# Altium project STM32_Phone.PrjPcb
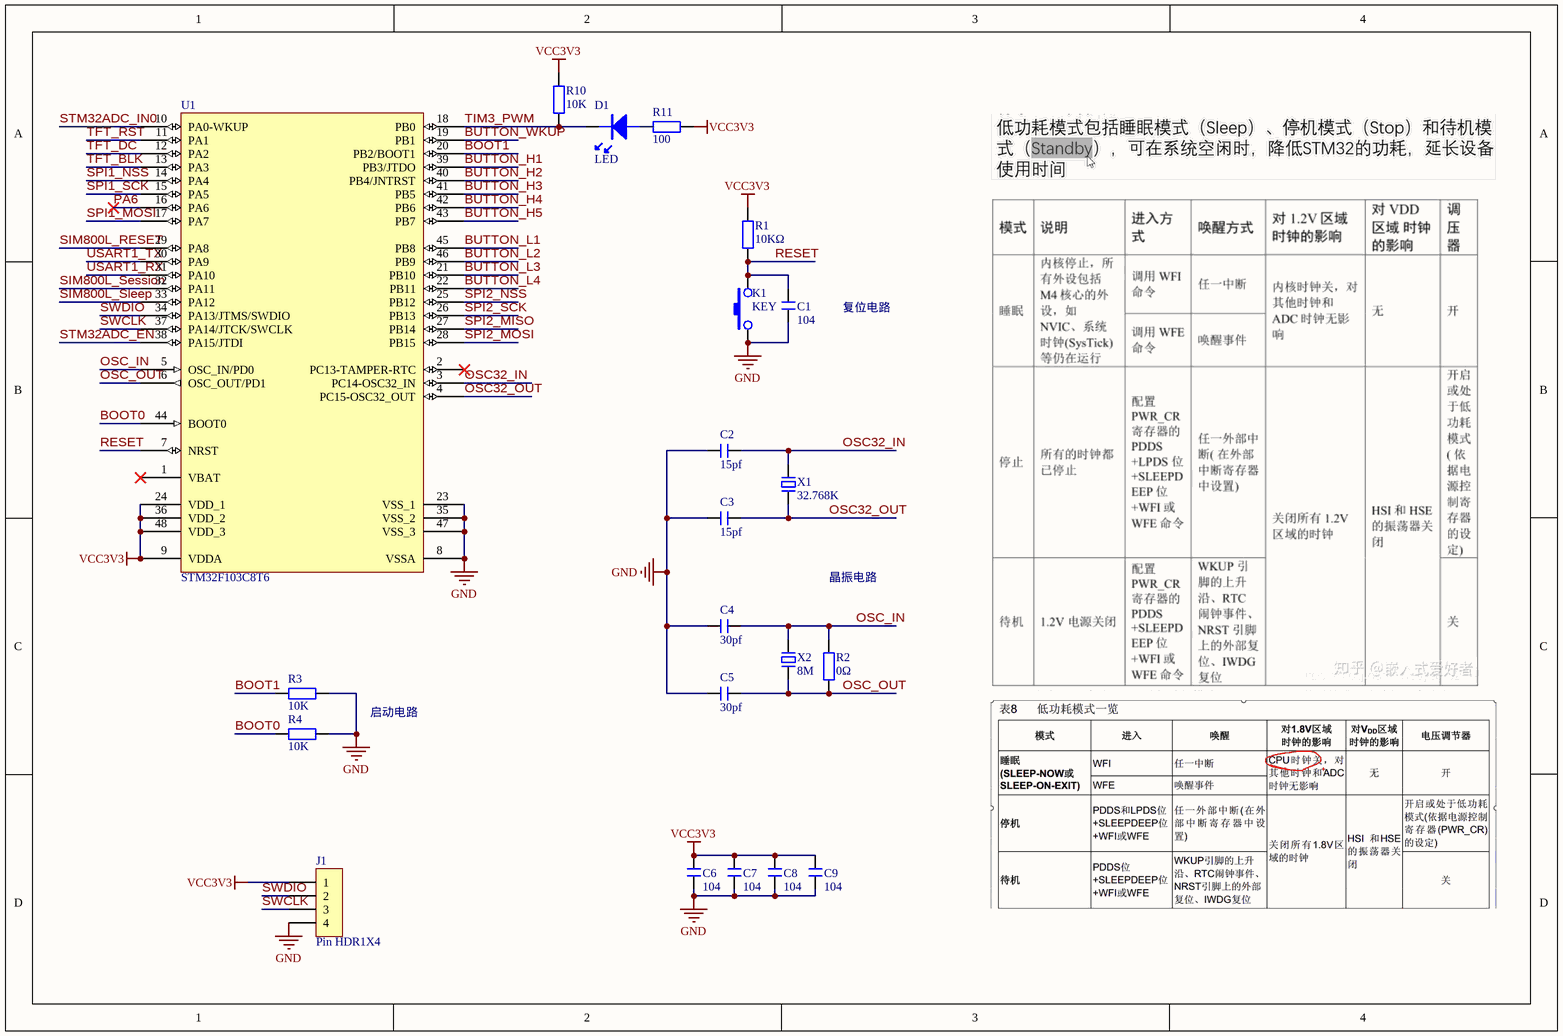
[diagram p0: STM32_miniSystem.SchDoc]
7 sheets, 80 parts. Net scope: global (net labels, ports and power ports of the same name join across sheets).
Board file: Phone.PcbDoc
Sheets:
  STM32_miniSystem.SchDoc
  SIM800L.SchDoc
  DC_DC.SchDoc
  BUTTON.SchDoc
  flash.SchDoc
  DISPLAY.SchDoc
  ACDC.SchDoc

## Sheet STM32_miniSystem.SchDoc
size A4; SheetNumber: 1; SheetTotal: 7

### Parts
C1  104  [C 0805_L]
C2  15pf  [CC 1.8*3.6]
C3  15pf  [CC 1.8*3.6]
C4  30pf  [CC 1.8*3.6]
C5  30pf  [CC 1.8*3.6]
C6  104  [C 0805_L]
C7  104  [C 0805_L]
C8  104  [C 0805_L]
C9  104  [C 0805_L]
D1  LED  [LED-0603G]
J1  Pin HDR1X4  [Pin HDR1X4/2.54mm-W]
K1  KEY  [DIP-12X12X6]
R1  10KΩ  [R 0805_L]
R2  0Ω  [R 0805_L]
R3  10K  [R 0805_L]
R4  10K  [R 0805_L]
R10  10K  [R 0805_L]
R11  100  [R 0805_L]
U1  STM32F103C8T6  [LQFP48 7X7]
X1  32.768K  [OSC-3x10-WI-B]
X2  8M  [OSC HC-49S]

### Nets
GND: C1.1 C2.1 C3.1 C4.1 C5.1 C6.1 C7.1 C8.1 C9.1 J1.4 K1.1 R3.2 R4.1 U1.8(VSSA) U1.23(VSS_1) U1.35(VSS_2) U1.47(VSS_3)
VCC3V3: C6.2 C7.2 C8.2 C9.2 J1.1 R1.2 R10.2 R11.2 U1.9(VDDA) U1.24(VDD_1) U1.36(VDD_2) U1.48(VDD_3)
BOOT0: R4.2 U1.44(BOOT0)
BOOT1: R3.1 U1.20(PB2/BOOT1)
BUTTON_H1: U1.39(PB3/JTDO)
BUTTON_H2: U1.40(PB4/JNTRST)
BUTTON_H3: U1.41(PB5)
BUTTON_H4: U1.42(PB6)
BUTTON_H5: U1.43(PB7)
BUTTON_L1: U1.45(PB8)
BUTTON_L2: U1.46(PB9)
BUTTON_L3: U1.21(PB10)
BUTTON_L4: U1.22(PB11)
BUTTON_WKUP: U1.19(PB1)
OSC32_IN: C2.2 U1.3(PC14-OSC32_IN) X1.2
OSC32_OUT: C3.2 U1.4(PC15-OSC32_OUT) X1.1
OSC_IN: C4.2 R2.2 U1.5(OSC_IN/PD0) X2.2
OSC_OUT: C5.2 R2.1 U1.6(OSC_OUT/PD1) X2.1
PA6: U1.16(PA6)
RESET: C1.2 K1.3 R1.1 U1.7(NRST)
SIM800L_RESET: U1.29(PA8)
SIM800L_Session: U1.32(PA11)
SIM800L_Sleep: U1.33(PA12)
SPI1_MOSI: U1.17(PA7)
SPI1_NSS: U1.14(PA4)
SPI1_SCK: U1.15(PA5)
SPI2_MISO: U1.27(PB14)
SPI2_MOSI: U1.28(PB15)
SPI2_NSS: U1.25(PB12)
SPI2_SCK: U1.26(PB13)
STM32ADC_EN: U1.38(PA15/JTDI)
STM32ADC_IN0: U1.10(PA0-WKUP)
SWCLK: J1.3 U1.37(PA14/JTCK/SWCLK)
SWDIO: J1.2 U1.34(PA13/JTMS/SWDIO)
TFT_BLK: U1.13(PA3)
TFT_DC: U1.12(PA2)
TFT_RST: U1.11(PA1)
TIM3_PWM: D1.K R10.1 U1.18(PB0)
USART1_RX: U1.31(PA10)
USART1_TX: U1.30(PA9)
NetD1_A: D1.A R11.1

Not connected (* = marked no-connect by the designer): U1 1(VBAT)* 2(PC13-TAMPER-RTC)*

### Notes on the sheet
- 复位电路
- 晶振电路
- 启动电路

### Library data of the parts
C1 C6-C9 = C: 无极性贴片电容; 版权归属: 源创客; 材质: X7R; BOM名称: 无极性贴片电容; 学习资源: www.ooocke.com
C2 C3 = C-CC_1: 直插瓷片电容; 版权归属: 源创客; BOM名称: 直插瓷片电容; 学习资源: www.ooocke.com
C4 C5 = C-CC_2: 直插瓷片电容; 版权归属: 源创客; BOM名称: 直插瓷片电容; 学习资源: www.ooocke.com
R1 R2 = R: 贴片电阻; 版权归属: 源创客; BOM名称: 贴片电阻; 学习资源: www.ooocke.com
R3 R4 R10 = R_3: 贴片电阻; 版权归属: 源创客; BOM名称: 贴片电阻; 学习资源: www.ooocke.com
R11 = R_2: 贴片电阻; 版权归属: 源创客; BOM名称: 贴片电阻; 学习资源: www.ooocke.com
X1 = XTAL-2P: 32.768K_2脚无源脚晶振
X2 = XTAL-2P_1: 8M_2脚无源脚晶振

## Sheet SIM800L.SchDoc
size A4; SheetNumber: 2; SheetTotal: 7
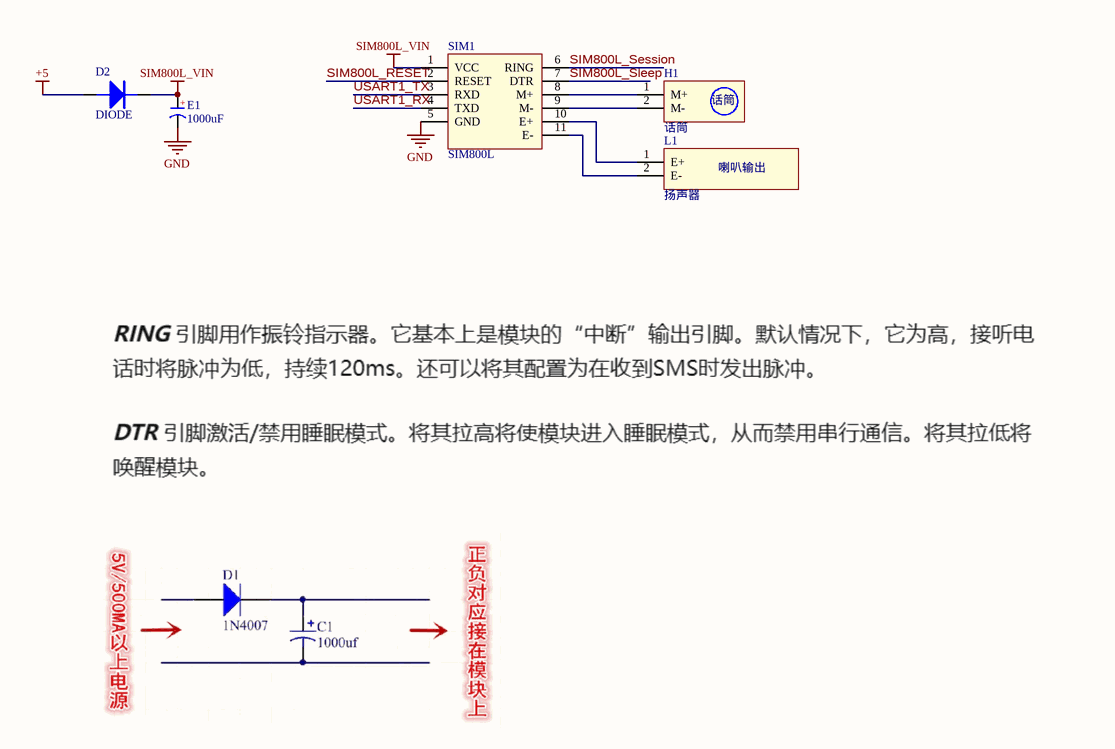
[diagram p1: SIM800L.SchDoc]

### Parts
D2  DIODE  [DO-15]
E1  1000uF  [CAP 1.5*4*8]
H1  话筒  [话筒]
L1  扬声器  [扬声器]
SIM1  SIM800L  [SIM800L]

### Nets
+5: D2.A
GND: E1.2(K) SIM1.5(GND)
SIM800L_VIN: D2.K E1.1(A) SIM1.1(VCC)
SIM800L_RESET: SIM1.2(RESET)
SIM800L_Session: SIM1.6(RING)
SIM800L_Sleep: SIM1.7(DTR)
USART1_RX: SIM1.4(TXD)
USART1_TX: SIM1.3(RXD)
NetH1_1: H1.1(M+) SIM1.8(M+)
NetH1_2: H1.2(M-) SIM1.9(M-)
NetL1_1: L1.1(E+) SIM1.10(E+)
NetL1_2: L1.2(E-) SIM1.11(E-)

### Notes on the sheet
- (in symbol C-CAP) +
- (in symbol 扬声器) 喇叭输出

### Library data of the parts
D2 = DIODE: 普通二极管
E1 = C-CAP: 直插电解电容; 版权归属: 源创客; BOM名称: 直插电解电容; 学习资源: www.ooocke.com

## Sheet DC_DC.SchDoc
size A4; SheetNumber: 3; SheetTotal: 7
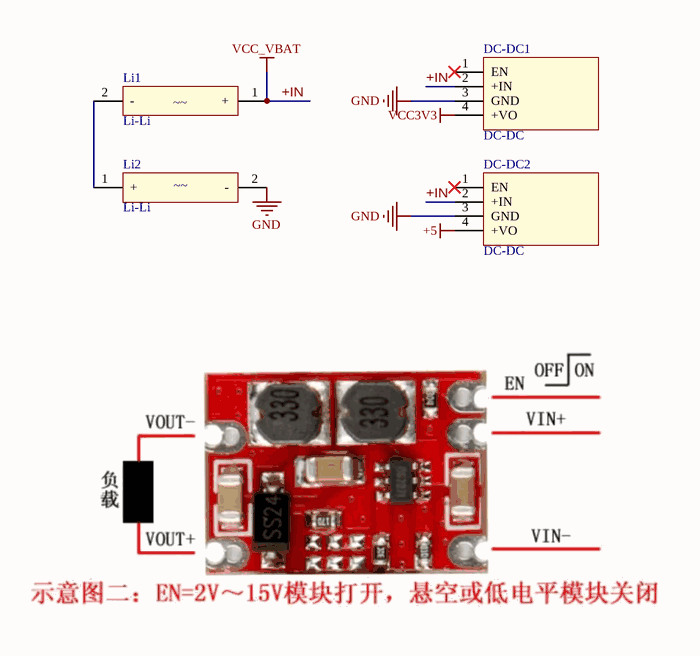
[diagram p2: DC_DC.SchDoc]

### Parts
DC-DC1  DC-DC  [DC-DC]
DC-DC2  DC-DC  [DC-DC]
Li1  Li-Li  [单个5号电池盒]
Li2  Li-Li  [单个5号电池盒]

### Nets
+5: DC-DC2.4(+VO)
+IN: DC-DC1.2(+IN) DC-DC2.2(+IN) Li1.1(+)  [also labelled VCC_VBAT]
GND: DC-DC1.3(GND) DC-DC2.3(GND) Li2.2(-)
VCC3V3: DC-DC1.4(+VO)
NetLi1_2: Li1.2(-) Li2.1(+)

Not connected (* = marked no-connect by the designer): DC-DC1 1(EN)*; DC-DC2 1(EN)*

### Notes on the sheet
- (in symbol Li-Li) ~~

## Sheet BUTTON.SchDoc
size A3; SheetNumber: 4; SheetTotal: 7
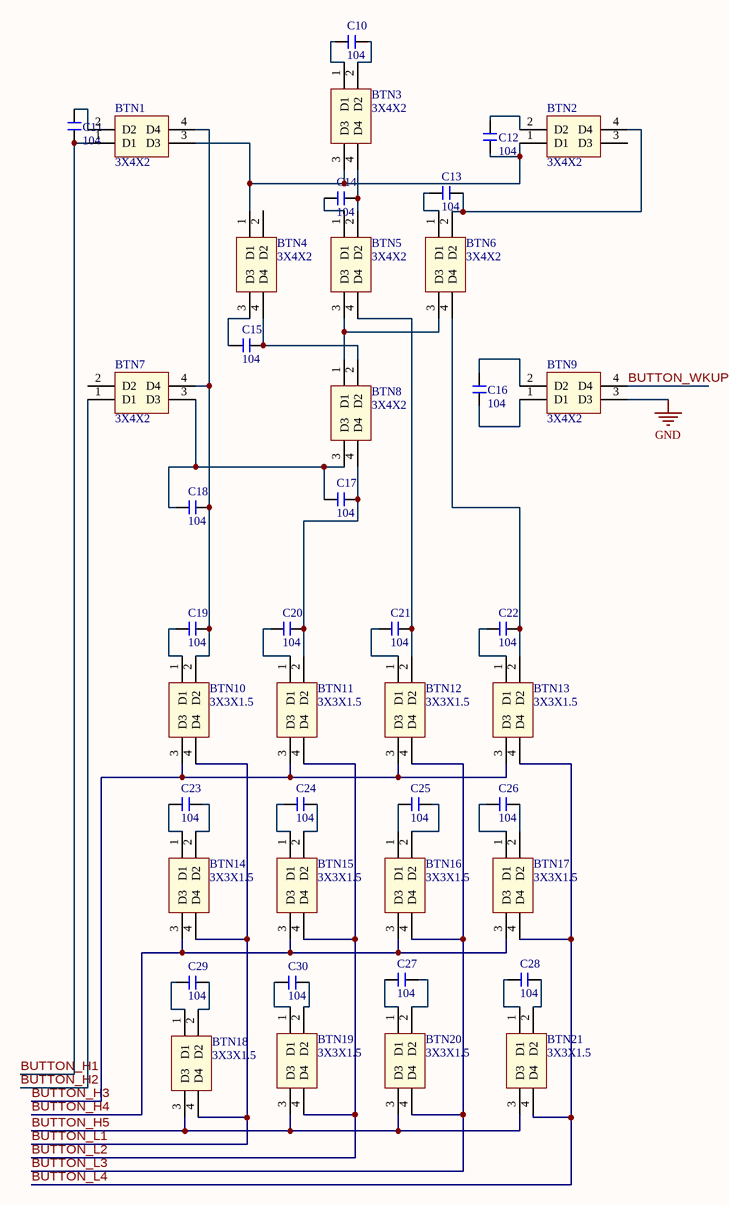
[diagram p3: BUTTON.SchDoc]

### Parts
BTN1  3X4X2  [3X4X2按钮]
BTN2  3X4X2  [3X4X2按钮]
BTN3  3X4X2  [3X4X2按钮]
BTN4  3X4X2  [3X4X2按钮]
BTN5  3X4X2  [3X4X2按钮]
BTN6  3X4X2  [3X4X2按钮]
BTN7  3X4X2  [3X4X2按钮]
BTN8  3X4X2  [3X4X2按钮]
BTN9  3X4X2  [3X4X2按钮]
BTN10  3X3X1.5  [3X3X1.5]
BTN11  3X3X1.5  [3X3X1.5]
BTN12  3X3X1.5  [3X3X1.5]
BTN13  3X3X1.5  [3X3X1.5]
BTN14  3X3X1.5  [3X3X1.5]
BTN15  3X3X1.5  [3X3X1.5]
BTN16  3X3X1.5  [3X3X1.5]
BTN17  3X3X1.5  [3X3X1.5]
BTN18  3X3X1.5  [3X3X1.5]
BTN19  3X3X1.5  [3X3X1.5]
BTN20  3X3X1.5  [3X3X1.5]
BTN21  3X3X1.5  [3X3X1.5]
C10  104  [C 0805_L]
C11  104  [C 0805_L]
C12  104  [C 0805_L]
C13  104  [C 0805_L]
C14  104  [C 0805_L]
C15  104  [C 0805_L]
C16  104  [C 0805_L]
C17  104  [C 0805_L]
C18  104  [C 0805_L]
C19  104  [C 0805_L]
C20  104  [C 0805_L]
C21  104  [C 0805_L]
C22  104  [C 0805_L]
C23  104  [C 0805_L]
C24  104  [C 0805_L]
C25  104  [C 0805_L]
C26  104  [C 0805_L]
C27  104  [C 0805_L]
C28  104  [C 0805_L]
C29  104  [C 0805_L]
C30  104  [C 0805_L]

### Nets
GND: BTN9.3(D3)
BUTTON_H1: BTN1.1(D1) C11.1
BUTTON_H2: BTN7.1(D1)
BUTTON_H3: BTN10.3(D3) BTN11.3(D3) BTN12.3(D3) BTN13.3(D3)
BUTTON_H4: BTN14.3(D3) BTN15.3(D3) BTN16.3(D3) BTN17.3(D3)
BUTTON_H5: BTN18.3(D3) BTN19.3(D3) BTN20.3(D3) BTN21.3(D3)
BUTTON_L1: BTN10.4(D4) BTN14.4(D4) BTN18.4(D4)
BUTTON_L2: BTN11.4(D4) BTN15.4(D4) BTN19.4(D4)
BUTTON_L3: BTN12.4(D4) BTN16.4(D4) BTN20.4(D4)
BUTTON_L4: BTN13.4(D4) BTN17.4(D4) BTN21.4(D4)
BUTTON_WKUP: BTN9.4(D4)
NetBTN1_2: BTN1.2(D2) C11.2
NetBTN1_3: BTN1.3(D3) BTN2.1(D1) BTN3.3(D3) BTN4.1(D1) C12.1
NetBTN1_4: BTN1.4(D4) BTN7.4(D4) BTN10.2(D2) C18.1 C19.1
NetBTN2_2: BTN2.2(D2) C12.2
NetBTN2_4: BTN2.4(D4) BTN6.2(D2) C13.2
NetBTN3_1: BTN3.1(D1) C10.1
NetBTN3_2: BTN3.2(D2) C10.2
NetBTN3_4: BTN3.4(D4) BTN5.2(D2) C14.2
NetBTN4_3: BTN4.3(D3) C15.1
NetBTN4_4: BTN4.4(D4) BTN8.2(D2) C15.2
NetBTN5_1: BTN5.1(D1) C14.1
NetBTN5_3: BTN5.3(D3) BTN6.3(D3) BTN8.1(D1)
NetBTN5_4: BTN5.4(D4) BTN12.2(D2) C21.1
NetBTN6_1: BTN6.1(D1) C13.1
NetBTN6_4: BTN6.4(D4) BTN13.2(D2) C22.1
NetBTN7_3: BTN7.3(D3) BTN8.3(D3) C17.1 C18.2
NetBTN8_4: BTN8.4(D4) BTN11.2(D2) C17.2 C20.1
NetBTN9_1: BTN9.1(D1) C16.1
NetBTN9_2: BTN9.2(D2) C16.2
NetBTN10_1: BTN10.1(D1) C19.2
NetBTN11_1: BTN11.1(D1) C20.2
NetBTN12_1: BTN12.1(D1) C21.2
NetBTN13_1: BTN13.1(D1) C22.2
NetBTN14_1: BTN14.1(D1) C23.2
NetBTN14_2: BTN14.2(D2) C23.1
NetBTN15_1: BTN15.1(D1) C24.2
NetBTN15_2: BTN15.2(D2) C24.1
NetBTN16_1: BTN16.1(D1) C25.1
NetBTN16_2: BTN16.2(D2) C25.2
NetBTN17_1: BTN17.1(D1) C26.2
NetBTN17_2: BTN17.2(D2) C26.1
NetBTN18_1: BTN18.1(D1) C29.2
NetBTN18_2: BTN18.2(D2) C29.1
NetBTN19_1: BTN19.1(D1) C30.2
NetBTN19_2: BTN19.2(D2) C30.1
NetBTN20_1: BTN20.1(D1) C27.2
NetBTN20_2: BTN20.2(D2) C27.1
NetBTN21_1: BTN21.1(D1) C28.2
NetBTN21_2: BTN21.2(D2) C28.1

Not connected (* = marked no-connect by the designer): BTN2 3(D3); BTN4 2(D2); BTN7 2(D2)

### Library data of the parts
C10-C30 = C: 无极性贴片电容; 版权归属: 源创客; 材质: X7R; BOM名称: 无极性贴片电容; 学习资源: www.ooocke.com

## Sheet flash.SchDoc
size A4; SheetNumber: 5; SheetTotal: 5
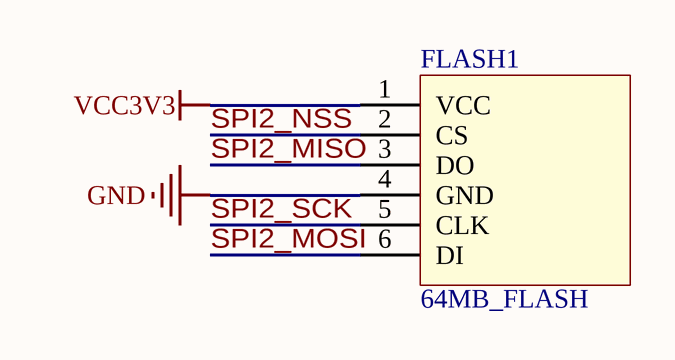
[diagram p4: flash.SchDoc]

### Parts
FLASH1  64MB_FLASH  [64MB_FLASH]

### Nets
GND: FLASH1.4(GND)
VCC3V3: FLASH1.1(VCC)
SPI2_MISO: FLASH1.3(DO)
SPI2_MOSI: FLASH1.6(DI)
SPI2_NSS: FLASH1.2(CS)
SPI2_SCK: FLASH1.5(CLK)

## Sheet DISPLAY.SchDoc
size A4; SheetNumber: 6; SheetTotal: 6
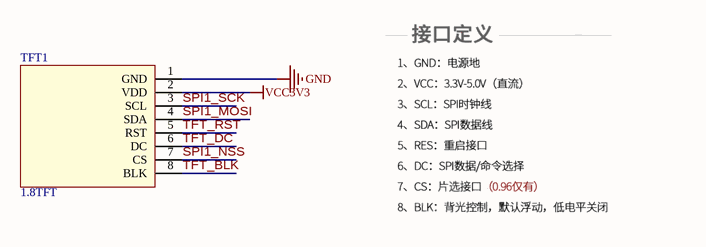
[diagram p5: DISPLAY.SchDoc]

### Parts
TFT1  1.8TFT  [1.8TFT]

### Nets
GND: TFT1.1(GND)
VCC3V3: TFT1.2(VDD)
SPI1_MOSI: TFT1.4(SDA)
SPI1_NSS: TFT1.7(CS)
SPI1_SCK: TFT1.3(SCL)
TFT_BLK: TFT1.8(BLK)
TFT_DC: TFT1.6(DC)
TFT_RST: TFT1.5(RST)

## Sheet ACDC.SchDoc
size A4; SheetNumber: 7; SheetTotal: 7
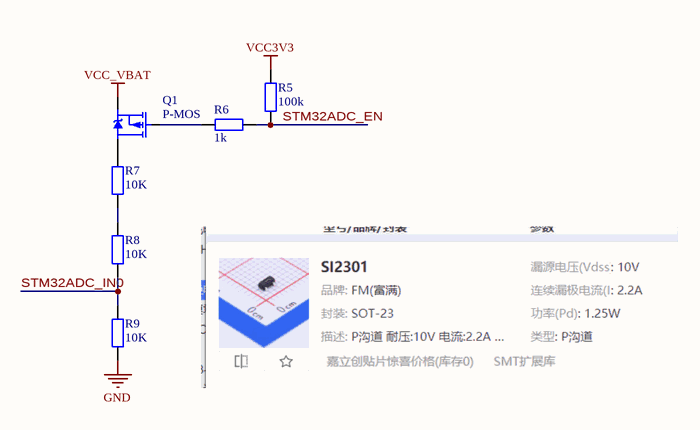
[diagram p6: ACDC.SchDoc]

### Parts
Q1  P-MOS  [SOT23]
R5  100k  [R 0805_L]
R6  1k  [R 0805_L]
R7  10K  [R 0805_L]
R8  10K  [R 0805_L]
R9  10K  [R 0805_L]

### Nets
GND: R9.1
VCC3V3: R5.2
VCC_VBAT: Q1.S  [project net +IN]
STM32ADC_EN: R5.1 R6.1
STM32ADC_IN0: R8.1 R9.2
NetQ1_D: Q1.D R7.2
NetQ1_G: Q1.G R6.2
NetR7_1: R7.1 R8.2

### Library data of the parts
Q1 = P-MOS: P沟道场效应管
R5 R6 = R_2: 贴片电阻; 版权归属: 源创客; BOM名称: 贴片电阻; 学习资源: www.ooocke.com
R7-R9 = R_3: 贴片电阻; 版权归属: 源创客; BOM名称: 贴片电阻; 学习资源: www.ooocke.com

## Nets that join several sheets
+5: SIM800L (D2.A), DC_DC (DC-DC2.4)
+IN: DC_DC (DC-DC1.2 DC-DC2.2 Li1.1), ACDC (Q1.S)
GND: STM32_miniSystem (17 pins), SIM800L (E1.2 SIM1.5), DC_DC (DC-DC1.3 DC-DC2.3 Li2.2), BUTTON (BTN9.3), flash (FLASH1.4), DISPLAY (TFT1.1), ACDC (R9.1)
VCC3V3: STM32_miniSystem (12 pins), DC_DC (DC-DC1.4), flash (FLASH1.1), DISPLAY (TFT1.2), ACDC (R5.2)
BUTTON_H1: STM32_miniSystem (U1.39), BUTTON (BTN1.1 C11.1)
BUTTON_H2: STM32_miniSystem (U1.40), BUTTON (BTN7.1)
BUTTON_H3: STM32_miniSystem (U1.41), BUTTON (BTN10.3 BTN11.3 BTN12.3 BTN13.3)
BUTTON_H4: STM32_miniSystem (U1.42), BUTTON (BTN14.3 BTN15.3 BTN16.3 BTN17.3)
BUTTON_H5: STM32_miniSystem (U1.43), BUTTON (BTN18.3 BTN19.3 BTN20.3 BTN21.3)
BUTTON_L1: STM32_miniSystem (U1.45), BUTTON (BTN10.4 BTN14.4 BTN18.4)
BUTTON_L2: STM32_miniSystem (U1.46), BUTTON (BTN11.4 BTN15.4 BTN19.4)
BUTTON_L3: STM32_miniSystem (U1.21), BUTTON (BTN12.4 BTN16.4 BTN20.4)
BUTTON_L4: STM32_miniSystem (U1.22), BUTTON (BTN13.4 BTN17.4 BTN21.4)
BUTTON_WKUP: STM32_miniSystem (U1.19), BUTTON (BTN9.4)
SIM800L_RESET: STM32_miniSystem (U1.29), SIM800L (SIM1.2)
SIM800L_Session: STM32_miniSystem (U1.32), SIM800L (SIM1.6)
SIM800L_Sleep: STM32_miniSystem (U1.33), SIM800L (SIM1.7)
SPI1_MOSI: STM32_miniSystem (U1.17), DISPLAY (TFT1.4)
SPI1_NSS: STM32_miniSystem (U1.14), DISPLAY (TFT1.7)
SPI1_SCK: STM32_miniSystem (U1.15), DISPLAY (TFT1.3)
SPI2_MISO: STM32_miniSystem (U1.27), flash (FLASH1.3)
SPI2_MOSI: STM32_miniSystem (U1.28), flash (FLASH1.6)
SPI2_NSS: STM32_miniSystem (U1.25), flash (FLASH1.2)
SPI2_SCK: STM32_miniSystem (U1.26), flash (FLASH1.5)
STM32ADC_EN: STM32_miniSystem (U1.38), ACDC (R5.1 R6.1)
STM32ADC_IN0: STM32_miniSystem (U1.10), ACDC (R8.1 R9.2)
TFT_BLK: STM32_miniSystem (U1.13), DISPLAY (TFT1.8)
TFT_DC: STM32_miniSystem (U1.12), DISPLAY (TFT1.6)
TFT_RST: STM32_miniSystem (U1.11), DISPLAY (TFT1.5)
USART1_RX: STM32_miniSystem (U1.31), SIM800L (SIM1.4)
USART1_TX: STM32_miniSystem (U1.30), SIM800L (SIM1.3)